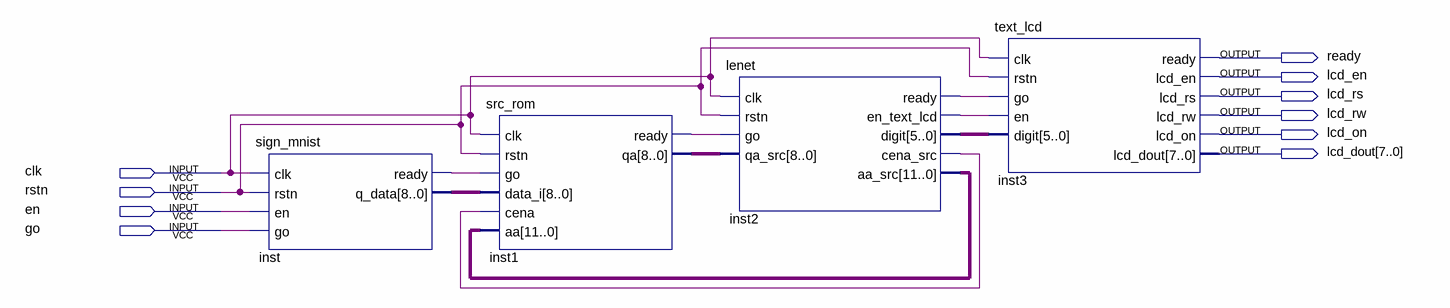
[diagram p0: schematic sheet]
// Quartus schematic lenet_sign_mnist_Quartus_block.bdf as structural Verilog: 4 symbols, 10 pins
module lenet_sign_mnist_Quartus_block (
  input  clk,
  input  rstn,
  input  en,
  input  go,
  output ready,
  output lcd_en,
  output lcd_rs,
  output lcd_rw,
  output lcd_on,
  output [7:0] lcd_dout
);

  wire inst1_ready, inst2_cena_src, inst2_en_text_lcd, inst2_ready, inst_ready;
  wire [5:0] inst2_digit;
  wire [8:0] inst1_qa, inst_q_data;
  wire [11:0] inst2_aa_src;

  sign_mnist inst (.clk(clk), .rstn(rstn), .en(en), .go(go), .ready(inst_ready), .q_data(inst_q_data));
  src_rom inst1 (
    .clk(clk), .rstn(rstn), .go(inst_ready), .data_i(inst_q_data), .cena(inst2_cena_src), .aa(inst2_aa_src),
    .ready(inst1_ready), .qa(inst1_qa));
  lenet inst2 (
    .clk(clk), .rstn(rstn), .go(inst1_ready), .qa_src(inst1_qa), .ready(inst2_ready),
    .en_text_lcd(inst2_en_text_lcd), .digit(inst2_digit), .cena_src(inst2_cena_src), .aa_src(inst2_aa_src));
  text_lcd inst3 (
    .clk(clk), .rstn(rstn), .go(inst2_ready), .en(inst2_en_text_lcd), .digit(inst2_digit), .ready(ready),
    .lcd_en(lcd_en), .lcd_rs(lcd_rs), .lcd_rw(lcd_rw), .lcd_on(lcd_on), .lcd_dout(lcd_dout));
endmodule
